# EasyEDA schematic test2-2_2021-01-17.json
TITLE: Sheet_1; REV: 1.0; Date: 2019-10-03; Sheet: 1/1; Drawn By: dragonlost; Company: Your Company
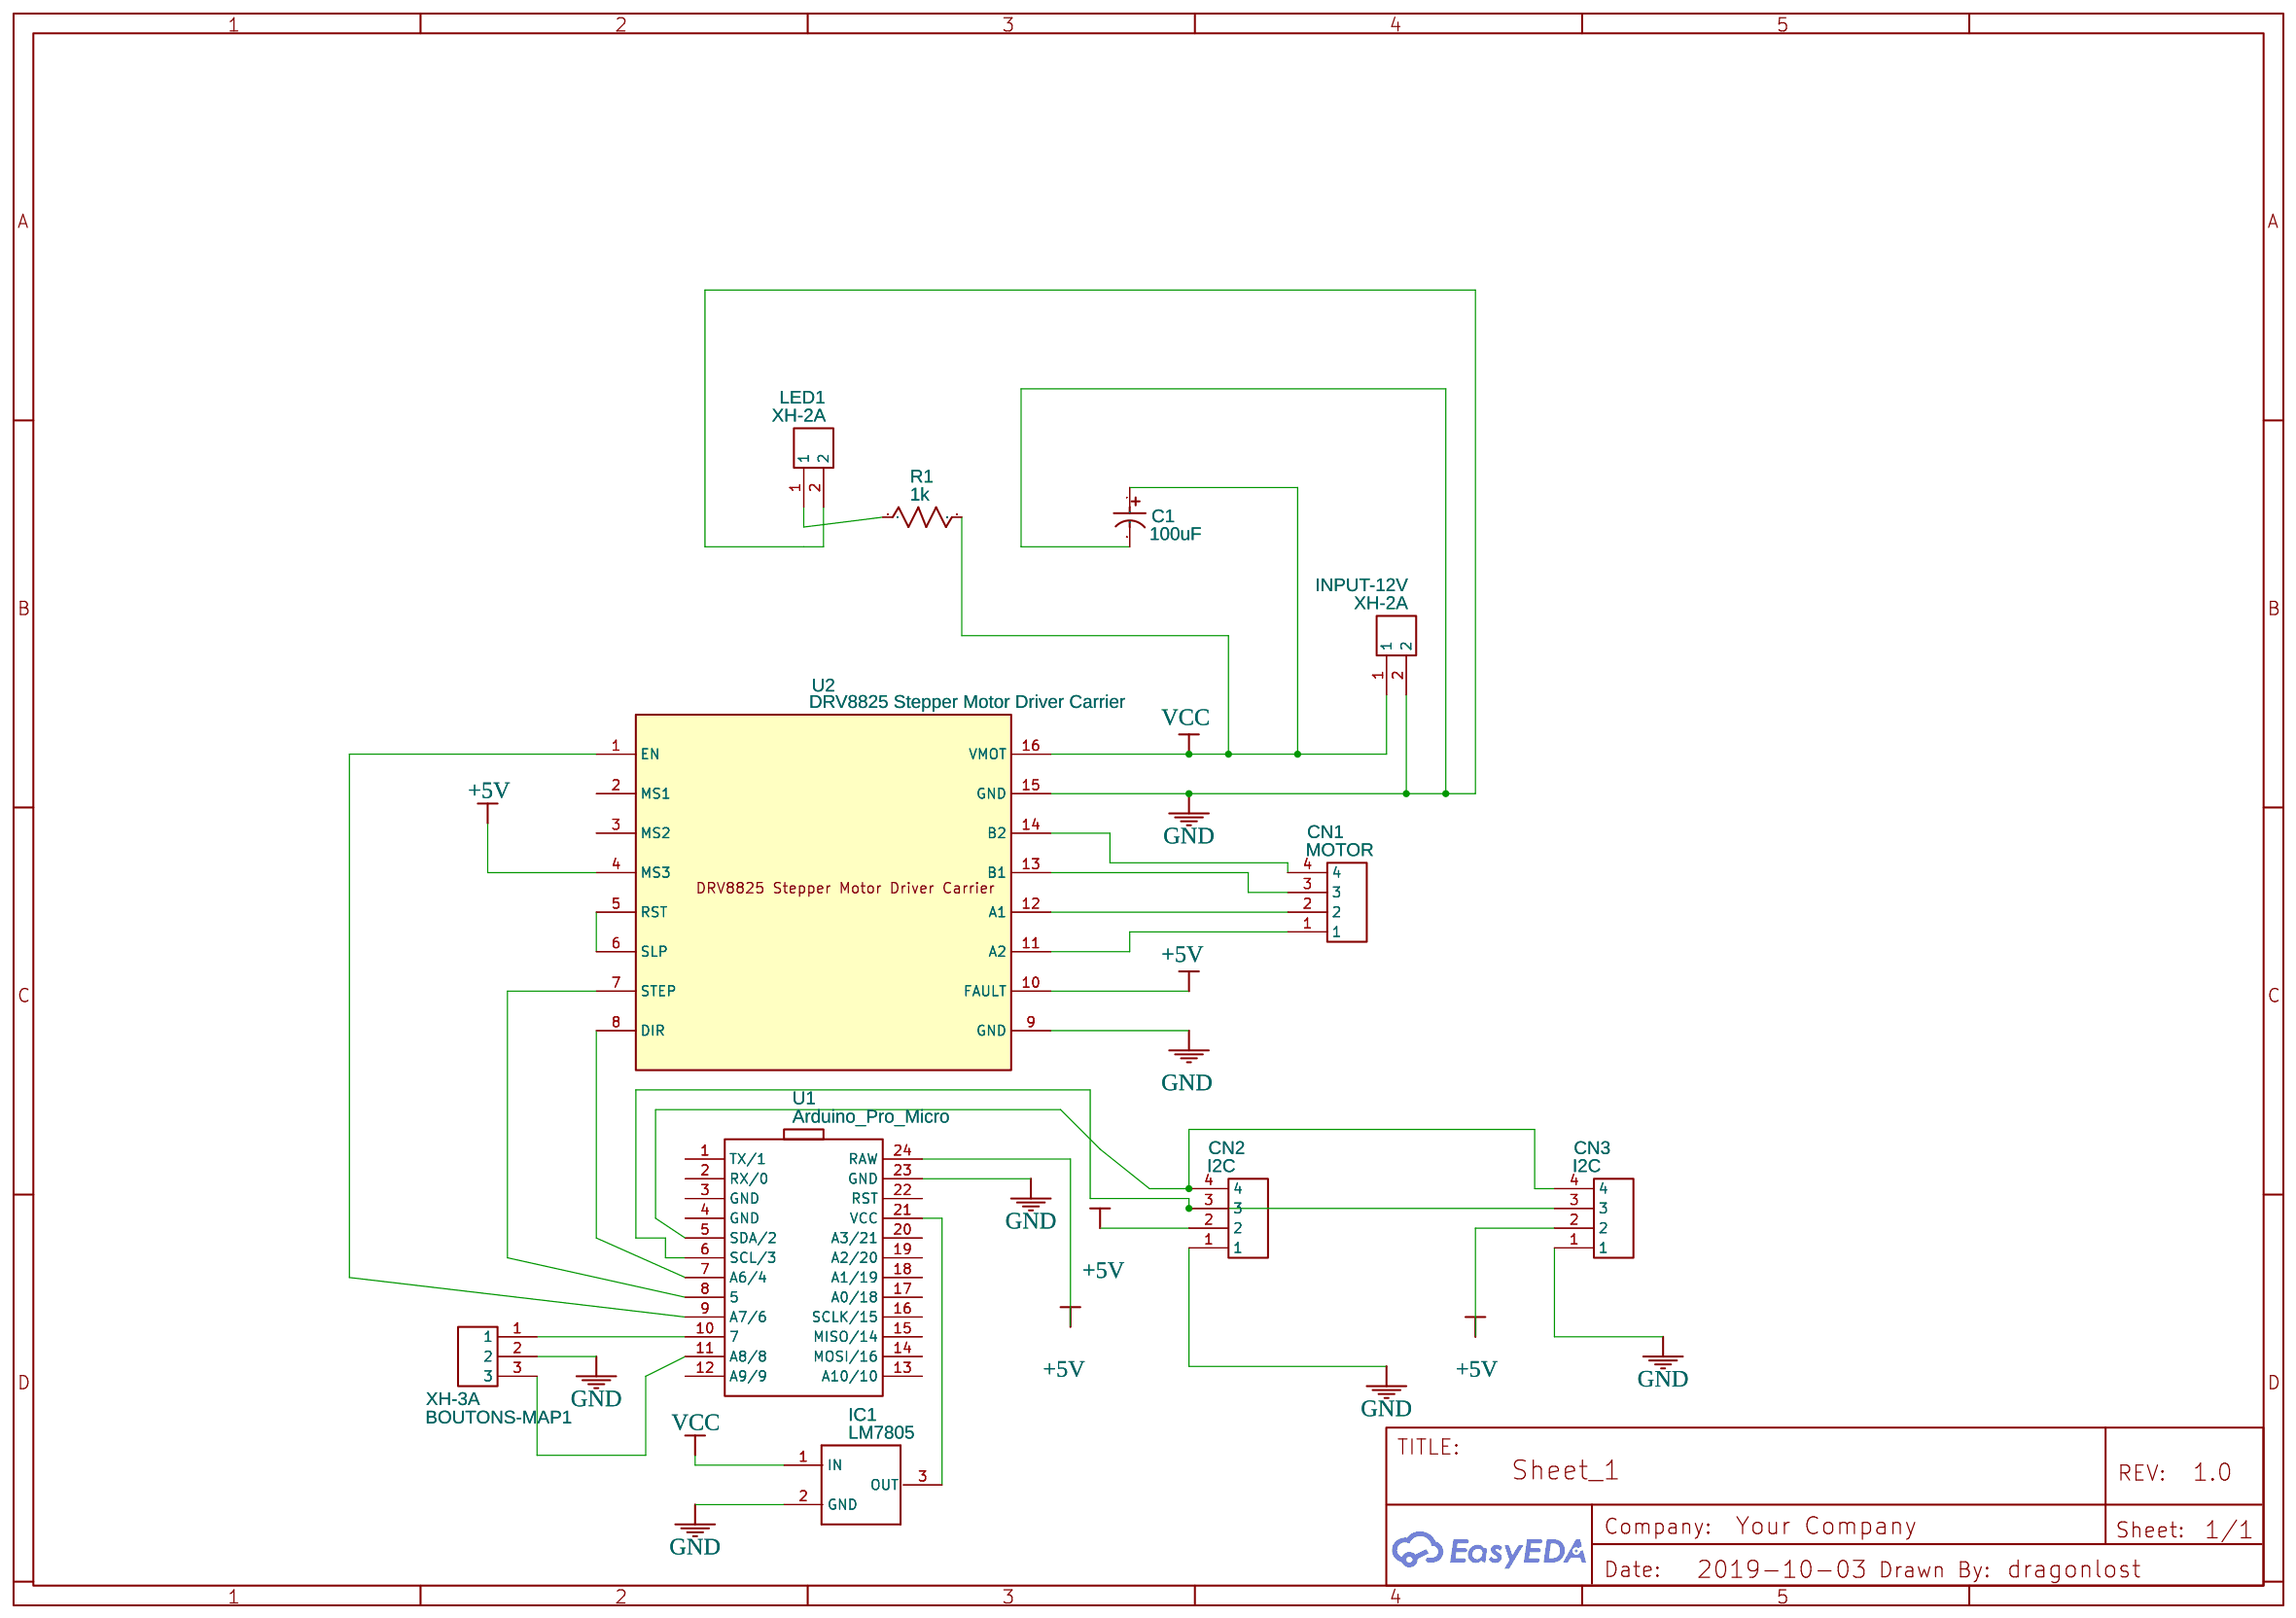
[diagram p0: schematic sheet]

## Parts
BOUTONS-MAP1  XH-3A  [XH-3A]
C1  100uF  [CAP-D8.0XF3.5]
CN1  MOTOR  [XH-4A]
CN2  I2C  [XH-4A]
CN3  I2C  [XH-4A]
IC1  LM7805  [TO220]
INPUT-12V  XH-2A  [XH-2A]
LED1  XH-2A  [XH-2A]
R1  1k  [AXIAL-0.3]
U1  Arduino_Pro_Micro  [ARDUINO_PRO_MICRO]
U2  DRV8825 Stepper Motor Driver Carrier  [DRV8825 STEPPER MOTOR DRIVER CARRIER]

## Library data of the parts
BOUTONS-MAP1 = -: Supplier: LCSC; Manufacturer: BOOMELE; image: //image.lceda.cn/szlcsc/C2316.jpg; Supplier Part: C2316
C1 = -: Voltage: 50V; Supplier: Mouser; Manufacturer: Panasonic; Manufacturer Part: ECA-1HM101; Digi-Key: P5182-ND; Supplier Part: 667-ECA-1HM101B
CN1-CN3 = -: Supplier: LCSC; Manufacturer: BOOMELE; image: //image.lceda.cn/szlcsc/C37815.jpg; Supplier Part: C37815
IC1 = -: Contributor: heshara
INPUT-12V LED1 = -: Supplier: LCSC; Manufacturer: BOOMELE; image: //image.lceda.cn/szlcsc/C20079.jpg; Supplier Part: C20079
R1 = Res_AXIAL-0.3(1/8W)_US
U1 = -: Manufacturer Part: Arduino Pro Micro; Contributor: zsteva
U2 = -: Contributor: winter2015; sourceId: YsmgyP7pj

## Nets
+5V: CN2.2 CN3.2 U1.24(RAW) U2.4(MS3) U2.10(FAULT)
GND: BOUTONS-MAP1.2 C1.2 CN2.1 CN3.1 IC1.2(GND) INPUT-12V.2 LED1.2 U1.23(GND) U2.9(GND) U2.15(GND)
VCC: C1.1 IC1.1(IN) INPUT-12V.1 R1.2 U2.16(VMOT)
Net-(BOUTONS-MAP1-1): BOUTONS-MAP1.1 U1.10(7)
Net-(BOUTONS-MAP1-3): BOUTONS-MAP1.3 U1.11(A8/8)
Net-(CN1-1): CN1.1 U2.11(A2)
Net-(CN1-2): CN1.2 U2.12(A1)
Net-(CN1-3): CN1.3 U2.13(B1)
Net-(CN1-4): CN1.4 U2.14(B2)
Net-(CN2-3): CN2.3 CN3.3 U1.6(SCL/3)
Net-(CN2-4): CN2.4 CN3.4 U1.5(SDA/2)
Net-(IC1-3): IC1.3(OUT) U1.21(VCC)
Net-(LED1-1): LED1.1 R1.1
Net-(U1-7): U1.7(A6/4) U2.8(DIR)
Net-(U1-8): U1.8(5) U2.7(STEP)
Net-(U1-9): U1.9(A7/6) U2.1(EN)
Net-(U2-5): U2.5(RST) U2.6(SLP)

Not connected (* = marked no-connect by the designer): U1 1(TX/1) 2(RX/0) 3(GND) 4(GND) 12(A9/9) 13(A10/10) 14(MOSI/16) 15(MISO/14) 16(SCLK/15) 17(A0/18) 18(A1/19) 19(A2/20) 20(A3/21) 22(RST); U2 2(MS1) 3(MS2)
